# EAGLE schematic Probe Board 1.0 (EAGLE 9.2.1)

## Sheet 1 of 3: ADC Schematic
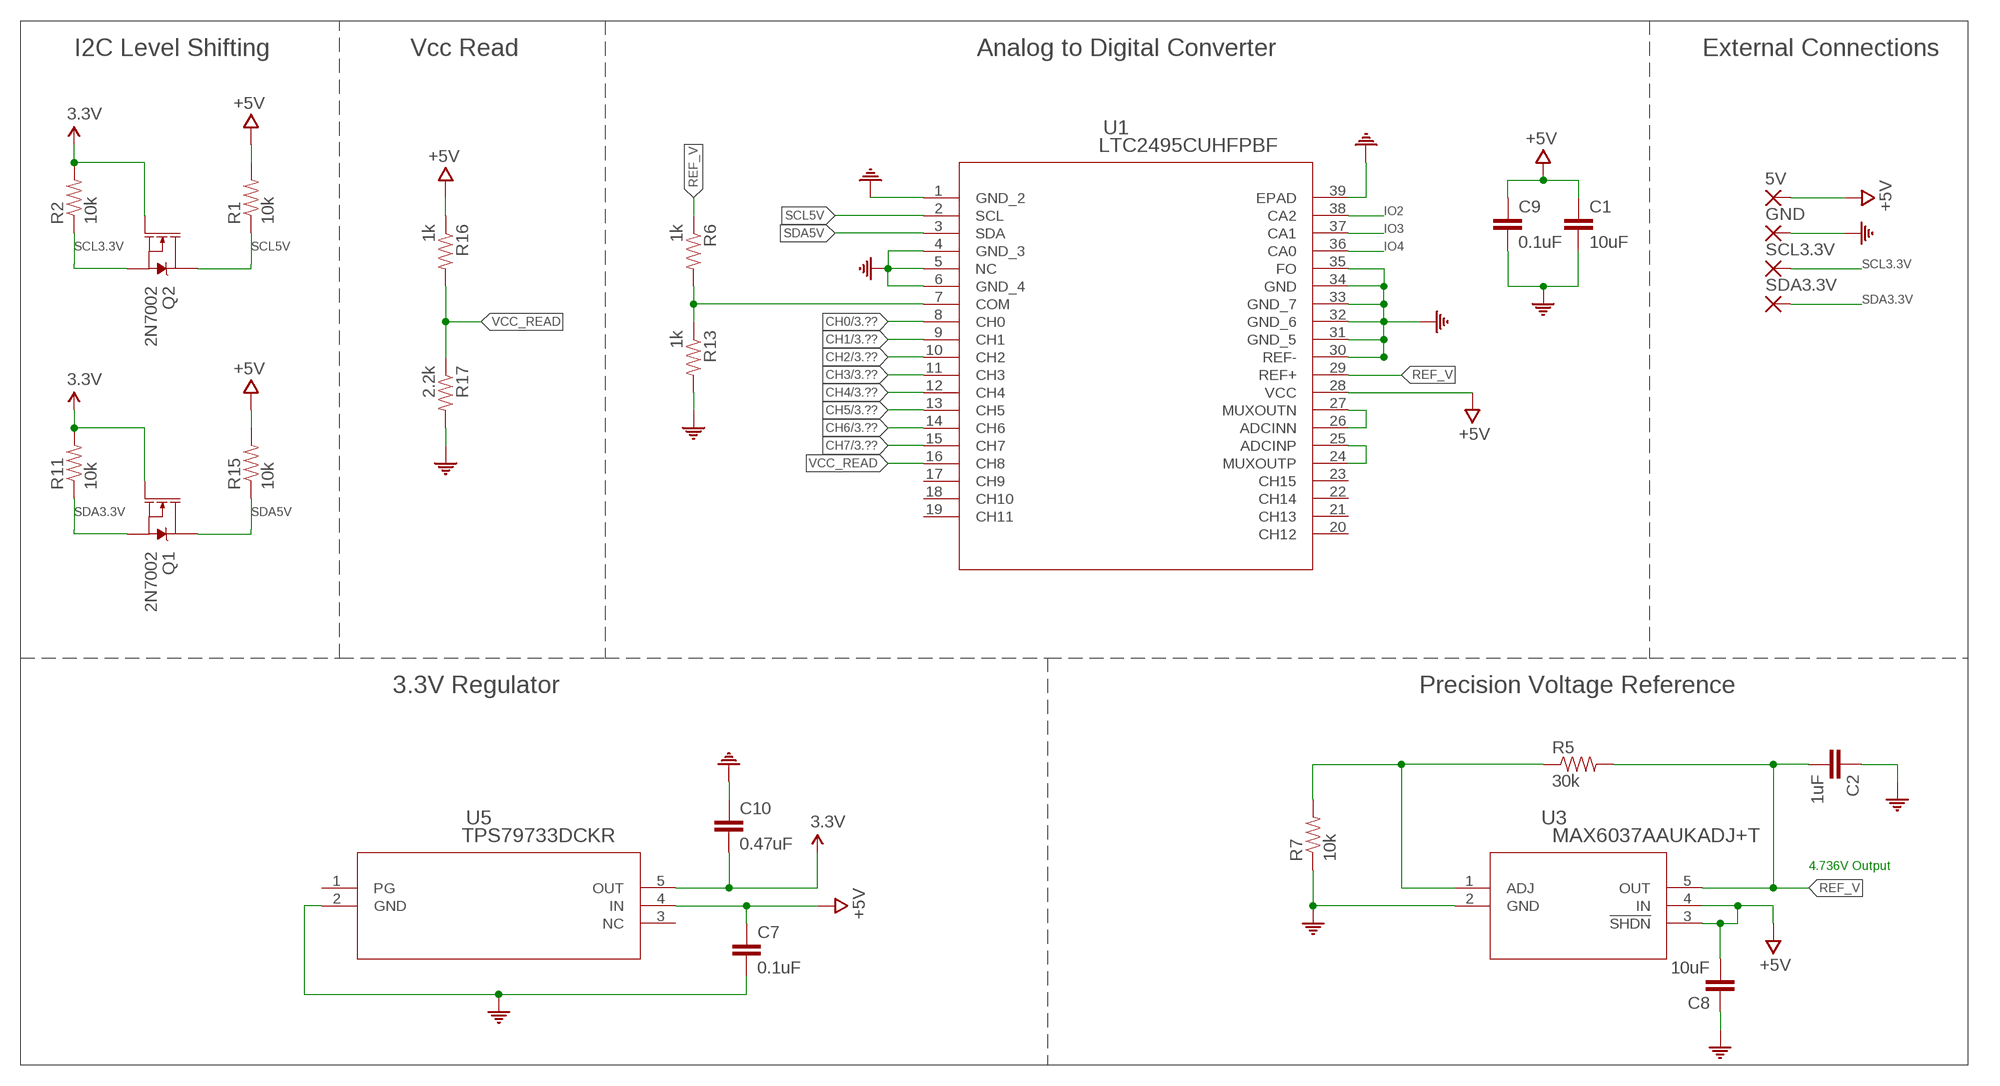
[diagram p0: schematic, sheet 1]

### Parts
5V  1,6/0,9  [1,6/0,9]
C1  10uF  CAP0603-CAP  [0603-CAP]
C2  1uF  CAP0603-CAP  [0603-CAP]
C7  0.1uF  CAP0603-CAP  [0603-CAP]
C8  10uF  CAP0603-CAP  [0603-CAP]
C9  0.1uF  CAP0603-CAP  [0603-CAP]
C10  0.47uF  CAP0603-CAP  [0603-CAP]
GND  1,6/0,9  [1,6/0,9]
Q1  2N7002  MOSFET-NCH-2N7002PW  [SOT323]
Q2  2N7002  MOSFET-NCH-2N7002PW  [SOT323]
R1  10k  RESISTOR0603-RES  [0603-RES]
R2  10k  RESISTOR0603-RES  [0603-RES]
R5  30k  RESISTOR0603-RES  [0603-RES]
R6  1k  RESISTOR0603-RES  [0603-RES]
R7  10k  RESISTOR0603-RES  [0603-RES]
R11  10k  RESISTOR0603-RES  [0603-RES]
R13  1k  RESISTOR0603-RES  [0603-RES]
R15  10k  RESISTOR0603-RES  [0603-RES]
R16  1k  RESISTOR0603-RES  [0603-RES]
R17  2.2k  RESISTOR0603-RES  [0603-RES]
SCL3.3V  1,6/0,9  [1,6/0,9]
SDA3.3V  1,6/0,9  [1,6/0,9]
U1  LTC2495CUHFPBF  [QFN-38_UHF]
U3  MAX6037AAUKADJ+T  [21-0057F]
U5  TPS79733DCKR  [DCK5]

### Nets
3.3V: C10.2 Q1.1(G) Q2.1(G) R2.2 R11.2 U5.5(OUT)
+5V: 5V.1(P) C1.1 C7.1 C8.2 C9.1 R1.2 R15.2 R16.1 U1.28(VCC) U3.3(!SHDN) U3.4(IN) U5.4(IN) ; also sheet 2,3
CH0: U1.8(CH0) ; also sheet 3
CH1: U1.9(CH1) ; also sheet 3
CH2: U1.10(CH2) ; also sheet 3
CH3: U1.11(CH3) ; also sheet 3
CH4: U1.12(CH4) ; also sheet 3
CH5: U1.13(CH5) ; also sheet 3
CH6: U1.14(CH6) ; also sheet 3
CH7: U1.15(CH7) ; also sheet 3
COM: C1.2 C2.1 C7.2 C8.1 C9.2 C10.1 GND.1(P) R7.1 R13.2 R17.2 U1.1(GND_2) U1.4(GND_3) U1.5(NC) U1.6(GND_4) U1.30(REF-) U1.31(GND_5) U1.32(GND_6) U1.33(GND_7) U1.34(GND) U1.35(FO) U1.39(EPAD) U3.2(GND) U5.2(GND) ; also sheet 2,3
IO2: U1.38(CA2) ; also sheet 2
IO3: U1.37(CA1) ; also sheet 2
IO4: U1.36(CA0) ; also sheet 2
N$2: U1.26(ADCINN) U1.27(MUXOUTN)
N$3: U1.24(MUXOUTP) U1.25(ADCINP)
N$5: R6.2 R13.1 U1.7(COM)
N$6: R5.1 R7.2 U3.1(ADJ)
REF_V: C2.2 R5.2 R6.1 U1.29(REF+) U3.5(OUT)
SCL3.3V: Q2.2(S) R2.1 SCL3.3V.1(P)
SCL5V: Q2.3(D) R1.1 U1.2(SCL)
SDA3.3V: Q1.2(S) R11.1 SDA3.3V.1(P)
SDA5V: Q1.3(D) R15.1 U1.3(SDA)
VCC_READ: R16.2 R17.1 U1.16(CH8)
Unconnected: U1.17(CH9) U1.18(CH10) U1.19(CH11) U1.20(CH12) U1.21(CH13) U1.22(CH14) U1.23(CH15) U5.1(PG) U5.3(NC)

### Notes on the sheet
- I2C Level Shifting | Vcc Read | Analog to Digital Converter | External Connections
- 3.3V Regulator | Precision Voltage Reference
- 4.736V Output

## Sheet 2 of 3: Arduino Schematic
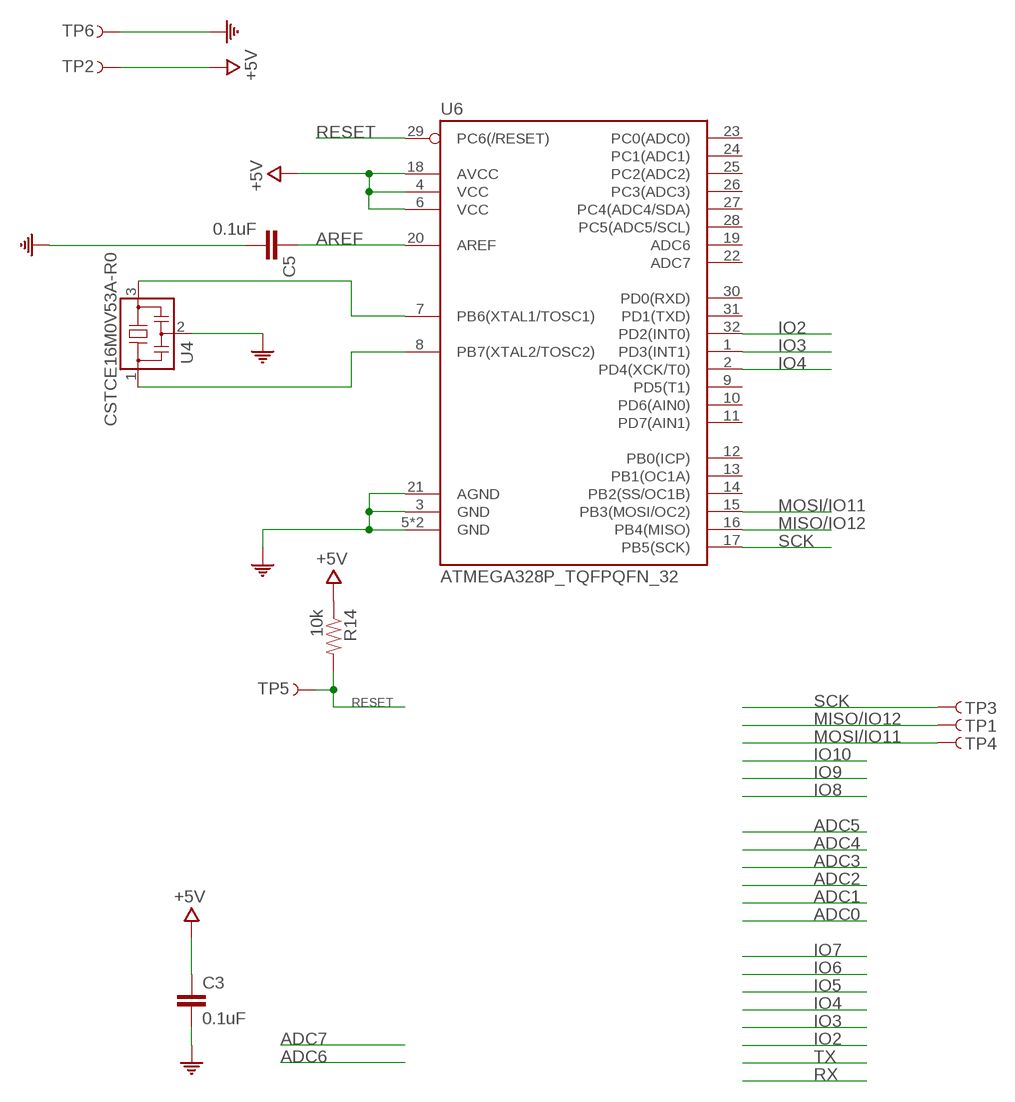
[diagram p1: schematic, sheet 2]

### Parts
C3  0.1uF  CAP0603-CAP  [0603-CAP]
C5  0.1uF  CAP0603-CAP  [0603-CAP]
R14  10k  RESISTOR0603-RES  [0603-RES]
TP1  TEST-POINT3  [PAD.03X.03]
TP2  TEST-POINT3  [PAD.03X.03]
TP3  TEST-POINT3  [PAD.03X.03]
TP4  TEST-POINT3  [PAD.03X.03]
TP5  TEST-POINT3  [PAD.03X.03]
TP6  TEST-POINT3  [PAD.03X.03]
U4  CSTCE16M0V53A-R0  [CSTCE_V]
U6  ATMEGA328P_TQFPQFN_32  [QFN32]

### Nets
+5V: C3.1 R14.1 TP2.P$1 U6.4(VCC) U6.6(VCC) U6.18(AVCC) ; also sheet 1,3
AREF: C5.1 U6.20(AREF)
COM: C3.2 C5.2 TP6.P$1 U4.2 U6.3(GND) U6.5(GND) U6.21(AGND) U6.EP(GND) ; also sheet 1,3
IO2: U6.32(PD2(INT0)) ; also sheet 1
IO3: U6.1(PD3(INT1)) ; also sheet 1
IO4: U6.2(PD4(XCK/T0)) ; also sheet 1
MISO/IO12: TP1.P$1 U6.16(PB4(MISO))
MOSI/IO11: TP4.P$1 U6.15(PB3(MOSI/OC2))
N$1: U4.3 U6.7(PB6(XTAL1/TOSC1))
N$7: U4.1 U6.8(PB7(XTAL2/TOSC2))
RESET: R14.2 TP5.P$1 U6.29(PC6(/RESET))
SCK: TP3.P$1 U6.17(PB5(SCK))
Unconnected: U6.9(PD5(T1)) U6.10(PD6(AIN0)) U6.11(PD7(AIN1)) U6.12(PB0(ICP)) U6.13(PB1(OC1A)) U6.14(PB2(SS/OC1B)) U6.19(ADC6) U6.22(ADC7) U6.23(PC0(ADC0)) U6.24(PC1(ADC1)) U6.25(PC2(ADC2)) U6.26(PC3(ADC3)) U6.27(PC4(ADC4/SDA)) U6.28(PC5(ADC5/SCL)) U6.30(PD0(RXD)) U6.31(PD1(TXD))

## Sheet 3 of 3: Thermistor Connections
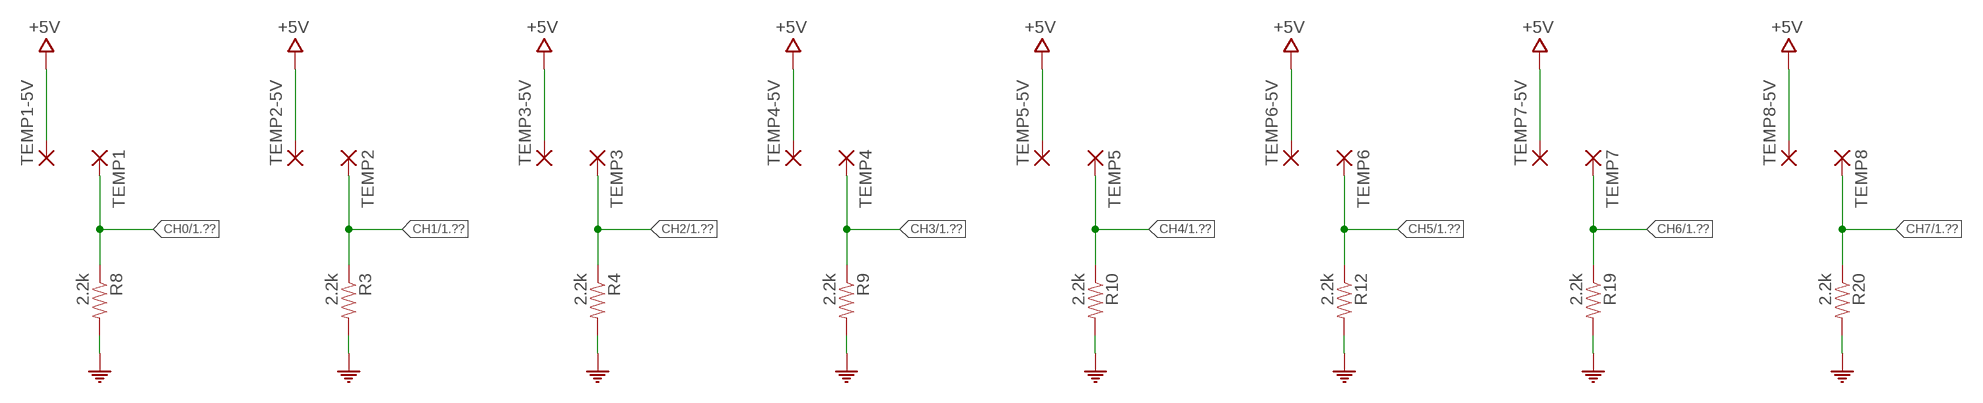
[diagram p2: schematic, sheet 3]

### Parts
R3  2.2k  RESISTOR0603-RES  [0603-RES]
R4  2.2k  RESISTOR0603-RES  [0603-RES]
R8  2.2k  RESISTOR0603-RES  [0603-RES]
R9  2.2k  RESISTOR0603-RES  [0603-RES]
R10  2.2k  RESISTOR0603-RES  [0603-RES]
R12  2.2k  RESISTOR0603-RES  [0603-RES]
R19  2.2k  RESISTOR0603-RES  [0603-RES]
R20  2.2k  RESISTOR0603-RES  [0603-RES]
TEMP1  1,6/0,9  [1,6/0,9]
TEMP1-5V  1,6/0,9  [1,6/0,9]
TEMP2  1,6/0,9  [1,6/0,9]
TEMP2-5V  1,6/0,9  [1,6/0,9]
TEMP3  1,6/0,9  [1,6/0,9]
TEMP3-5V  1,6/0,9  [1,6/0,9]
TEMP4  1,6/0,9  [1,6/0,9]
TEMP4-5V  1,6/0,9  [1,6/0,9]
TEMP5  1,6/0,9  [1,6/0,9]
TEMP5-5V  1,6/0,9  [1,6/0,9]
TEMP6  1,6/0,9  [1,6/0,9]
TEMP6-5V  1,6/0,9  [1,6/0,9]
TEMP7  1,6/0,9  [1,6/0,9]
TEMP7-5V  1,6/0,9  [1,6/0,9]
TEMP8  1,6/0,9  [1,6/0,9]
TEMP8-5V  1,6/0,9  [1,6/0,9]

### Nets
+5V: TEMP1-5V.1(P) TEMP2-5V.1(P) TEMP3-5V.1(P) TEMP4-5V.1(P) TEMP5-5V.1(P) TEMP6-5V.1(P) TEMP7-5V.1(P) TEMP8-5V.1(P) ; also sheet 1,2
CH0: R8.1 TEMP1.1(P) ; also sheet 1
CH1: R3.1 TEMP2.1(P) ; also sheet 1
CH2: R4.1 TEMP3.1(P) ; also sheet 1
CH3: R9.1 TEMP4.1(P) ; also sheet 1
CH4: R10.1 TEMP5.1(P) ; also sheet 1
CH5: R12.1 TEMP6.1(P) ; also sheet 1
CH6: R19.1 TEMP7.1(P) ; also sheet 1
CH7: R20.1 TEMP8.1(P) ; also sheet 1
COM: R3.2 R4.2 R8.2 R9.2 R10.2 R12.2 R19.2 R20.2 ; also sheet 1,2

## Library data of the parts
5V GND SCL3.3V SDA3.3V TEMP1 TEMP1-5V TEMP2 TEMP2-5V TEMP3 TEMP3-5V TEMP4 TEMP4-5V TEMP5 TEMP5-5V TEMP6 TEMP6-5V TEMP7 TEMP7-5V TEMP8 TEMP8-5V = wirepad:1,6/0,9: THROUGH-HOLE PAD
C1 C8 = SparkFun:CAP: Capacitor Standard 0603 ceramic capacitor, and 0.1" leaded capacitor.; DIGIKEY_PART_NUMBER: 445-9104-6-ND; MANUFACTURER: TDK Corporation; MANUFACTURER_PART_NUMBER: C1608X7S0J106M080AC; PRICE: 0.18328
C2 = SparkFun:CAP: Capacitor Standard 0603 ceramic capacitor, and 0.1" leaded capacitor.; DIGIKEY_PART_NUMBER: 1276-1184-6-ND; MANUFACTURER: Samsung Electro-Mechanics; MANUFACTURER_PART_NUMBER: CL10B105KA8NNNC; PRICE: 0.01719
C3 C5 C7 C9 = SparkFun:CAP: Capacitor Standard 0603 ceramic capacitor, and 0.1" leaded capacitor.; DIGIKEY_PART_NUMBER: 478-7939-2-ND; MANUFACTURER: AVX Corporation; MANUFACTURER_PART_NUMBER: 0603ZC104KAT2A; PRICE: 0.08325
C10 = SparkFun:CAP: Capacitor Standard 0603 ceramic capacitor, and 0.1" leaded capacitor.; DIGIKEY_PART_NUMBER: 478-10367-1-ND; MANUFACTURER: AVX Corporation; MANUFACTURER_PART_NUMBER: 0603ZC474KAT2A; PRICE: 0.02904
Q1 Q2 = bschulz:MOSFET-NCH: N-channel MOSFETs Voltage controlled devices that allow control of high current outputs. SparkFun Products: SparkFun OpenScale <https://www.sparkfun.com/products/13261> SparkFun Digital Sandbox <https://www.sparkfun.com/products/12651> SparkFun Monster Moto Shield <https://www.sparkfun.com/products/10182> SparkFun MOSFET Power Controller <https://www.sparkfun.com/products/11214>; DIGIKEY: 2N7002W-FDICT-ND; MF: Diodes Incorporated; MPN: 2N7002W-7-F; PROD_ID: TRANS-11151
R1 R2 R7 R11 R14 R15 = SparkFun:RESISTOR: Resistor Basic schematic elements and footprints for 0603, 1206, and PTH resistors.; DIGIKEY_PART_NUMBER: P10KGTR-ND; MANUFACTURER: Panasonic Electronic Components; MANUFACTURER_PART_NUMBER: ERJ-3GEYJ103V; PRICE: 0.00494
R3 R4 R8-R10 R12 R17 R19 R20 = SparkFun:RESISTOR: Resistor Basic schematic elements and footprints for 0603, 1206, and PTH resistors.; DIGIKEY_PART_NUMBER: P2.2KDBTR-ND; MANUFACTURER: Panasonic Electronic Components; MANUFACTURER_PART_NUMBER: ERA-3AEB222V; PRICE: 0.03717
R5 = SparkFun:RESISTOR: Resistor Basic schematic elements and footprints for 0603, 1206, and PTH resistors.; DIGIKEY_PART_NUMBER: P30KGDKR-ND; MANUFACTURER: Panasonic Electronic Components; MANUFACTURER_PART_NUMBER: ERJ-3GEYJ303V; PRICE: 0.00758
R6 R13 R16 = SparkFun:RESISTOR: Resistor Basic schematic elements and footprints for 0603, 1206, and PTH resistors.; DIGIKEY_PART_NUMBER: P1.0KDBDKR-ND; MANUFACTURER: Panasonic Electronic Components; MANUFACTURER_PART_NUMBER: ERA-3AEB102V; PRICE: 0.04906
TP1-TP6 = SparkFun-Passives:TEST-POINT: Bare copper test points for troubleshooting or ICT
U1 = LTC2495:LTC2495CUHFPBF; DIGIKEY_PART_NUMBER: LTC2495IUHF#PBF-ND; MANUFACTURER: Linear Technology/Analog Devices; MANUFACTURER_PART_NUMBER: LTC2495CUHF#PBF; PRICE: 5.11040; VENDOR: Linear Technology
U3 = MAX6037AAUKADJ:MAX6037AAUKADJ+T; DIGIKEY_PART_NUMBER: MAX6037AAUK33+TCT-ND; MANUFACTURER: Maxim Integrated; MANUFACTURER_PART_NUMBER: MAX6037AAUK33+T; PRICE: 2.59488; VENDOR: Maxim Integrated Products
U4 = Murata Resonator:CSTCE16M0V53A-R0; DIGIKEY_PART_NUMBER: 490-1198-1-ND; MANUFACTURER: Murata Electronics North America; MANUFACTURER_PART_NUMBER: CSTCE16M0V53-R0; PRICE: 0.26858; VENDOR: Murata
U5 = TPS79733:TPS79733DCKR; DIGIKEY_PART_NUMBER: 296-11990-6-ND; MANUFACTURER: Texas Instruments; MANUFACTURER_PART_NUMBER: TPS79733DCKR; PRICE: 0.46196; VENDOR: Texas Instruments
U6 = bschulz:ATMEGA328P_TQFP: Popular 328P in QFP Storefront component: ATmega328 - TQFP <https://www.sparkfun.com/products/13448> (COM-13448) Datasheet <http://www.sparkfun.com/datasheets/Components/SMD/ATMega328.pdf> SparkFun Products SparkFun RedBoard - Programmed with Arduino <https://www.sparkfun.com/products/12757> (DEV-12757) Arduino Pro Mini 328 - 5V/16MHz <https://www.sparkfun.com/products/11113> (DEV-11113) Arduino Pro Mini 328 - 3.3V/8MHz <https://www.sparkfun.com/products/11114> (DEV-11114) SparkFun OpenLog <https://www.sparkfun.com/products/13712> (DEV-13712) SparkFun MicroView - OLED Arduino Module <https://www.sparkfun.com/products/12923> (DEV-12923) SparkFun Digital Sandbox <https://www.sparkfun.com/products/12651> (DEV-12651) SparkFun PicoBoard <https://www.sparkfun.com/products/11888> (WIG-11888) Arduino Fio <https://www.sparkfun.com/products/10116> (DEV-10116) LilyPad Arduino 328 Main Board <https://www.sparkfun.com/products/13342> (DEV-13342) SparkFun RedStick <https://www.sparkfun.com/products/13741> (DEV-13741) LilyPad MP3 <https://www.sparkfun.com/products/11013> (DEV-11013) LilyPad Arduino SimpleSnap <https://www.sparkfun.com/products/10941> (DEV-10941) SparkFun Stepoko <https://www.sparkfun.com/products/13899> (ROB-13899) SparkFun Geiger Counter <https://www.sparkfun.com/products/11345> (SEN-11345) SparkFun EL Sequencer <https://www.sparkfun.com/products/12781> (COM-12781) Arduino Pro 328 - 5V/16MHz <https://www.sparkfun.com/products/10915> (DEV-10915) CryptoCape <https://www.sparkfun.com/products/12773> (DEV-12773) SparkFun IR Thermometer Evaluation Board - MLX90614 <https://www.sparkfun.com/products/10740> (SEN-10740) SparkFun RedBot Mainboard <https://www.sparkfun.com/products/12097> (ROB-12097) Arduino Pro 328 - 3.3V/8MHz <https://www.sparkfun.com/products/10914> (DEV-10914) SparkFun Block for Intel® Edison - Arduino <https://www.sparkfun.com/products/13036> (DEV-13036) SparkFun Simon Says - Surface Mount Soldering Kit <https://www.sparkfun.com/products/10935> (KIT-10935) SparkFun 7-Segment Serial Display - Red <https://www.sparkfun.com/products/11441> (COM-11441) SparkFun 7-Segment Serial Display - White <https://www.sparkfun.com/products/11629> (COM-11629) SparkFun 7-Segment Serial Display - Yellow <https://www.sparkfun.com/products/11443> (COM-11443) SparkFun 7-Segment Serial Display - Kelly Green <https://www.sparkfun.com/products/11440> (COM-11440) SparkFun 7-Segment Serial Display - Blue <https://www.sparkfun.com/products/11442> (COM-11442) SparkFun OpenSegment Serial Display - 20mm (Blue) <https://www.sparkfun.com/products/11647> (COM-11647) SparkFun OpenSegment Serial Display - 20mm (Green) <https://www.sparkfun.com/products/11646> (COM-11646) SparkFun OpenSegment Serial Display - 20mm (White) <https://www.sparkfun.com/products/11648> (COM-11648) SparkFun OpenSegment Serial Display - 20mm (Red) <https://www.sparkfun.com/products/11644> (COM-11644) SparkFun OpenSegment Serial Display - 20mm (Yellow) <https://www.sparkfun.com/products/11645> (COM-11645) SparkFun OpenSegment Shield <https://www.sparkfun.com/products/13190> (DEV-13190); DIGIKEY: ATMEGA328P-MURCT-ND; MF: Atmel; MPN: ATMEGA328P-MUR

## Net classes
0 default: width 0.203 mm